# EAGLE design can (EAGLE 7.4.0)
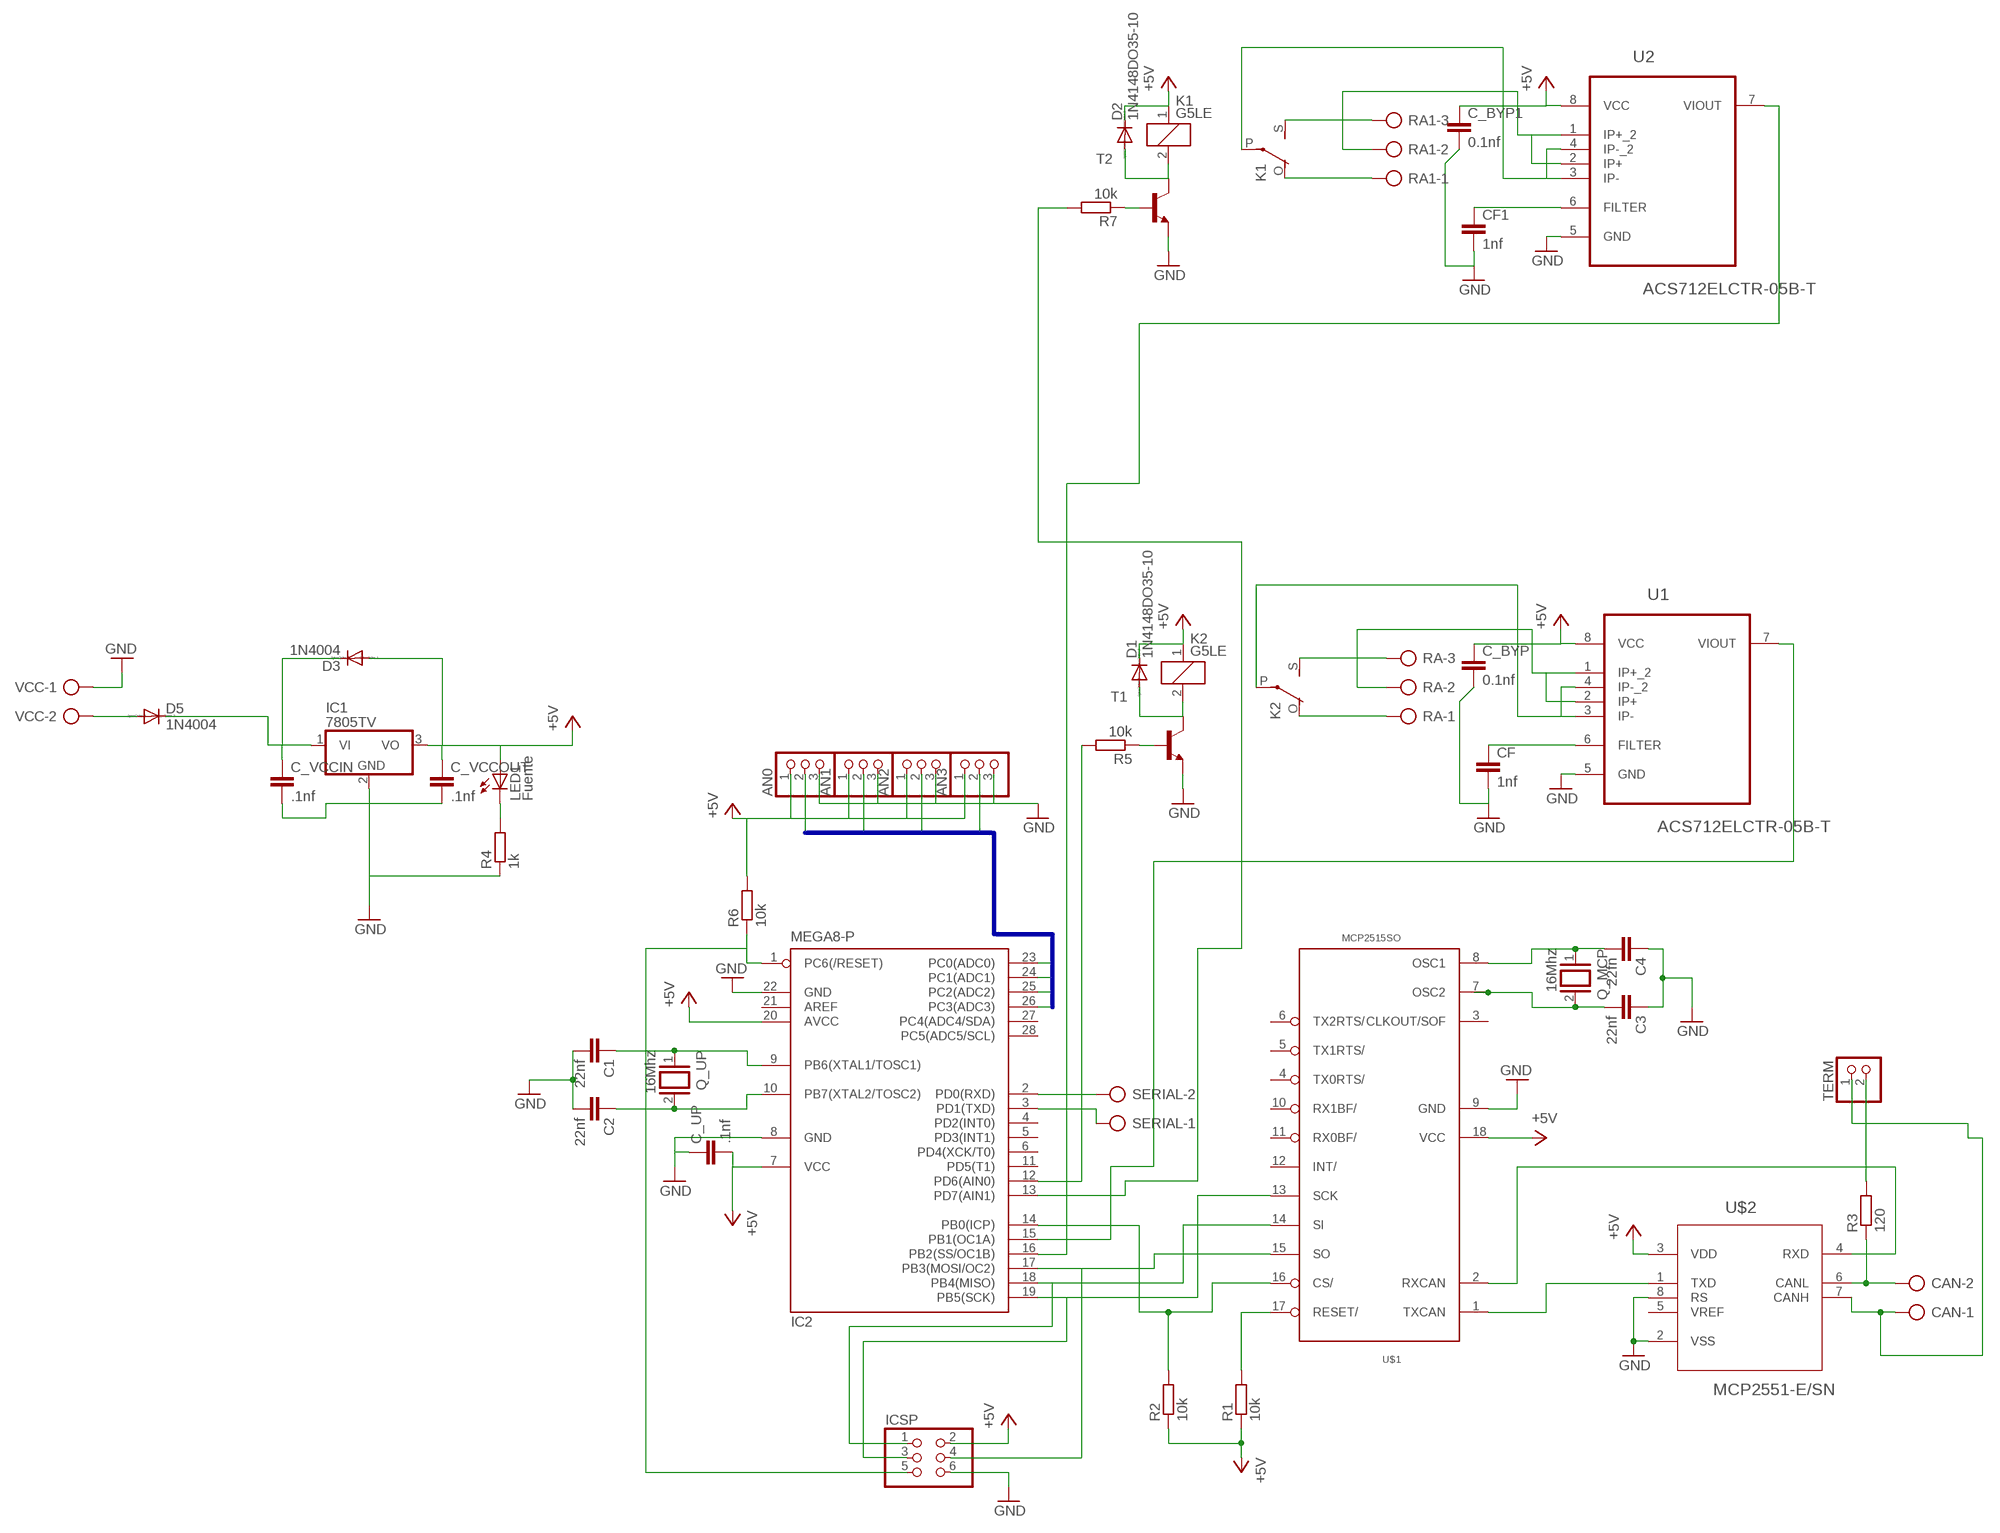
[diagram p0: schematic, sheet 1]

## Parts
AN0  PINHD-1X3  [1X03]
AN1  PINHD-1X3  [1X03]
AN2  PINHD-1X3  [1X03]
AN3  PINHD-1X3  [1X03]
C1  22nf  C-EU025-025X050  [C025-025X050]
C2  22nf  C-EU025-025X050  [C025-025X050]
C3  22nf  C-EU025-025X050  [C025-025X050]
C4  22fn  C-EU025-025X050  [C025-025X050]
C_BYP  0.1nf  C-EU025-025X050  [C025-025X050]
C_BYP1  0.1nf  C-EU025-025X050  [C025-025X050]
C_UP  .1nf  C-EU025-025X050  [C025-025X050]
C_VCCIN  .1nf  C-EU025-025X050  [C025-025X050]
C_VCCOUT  .1nf  C-EU025-025X050  [C025-025X050]
CAN  AK500/2  [AK500/2]
CF  1nf  C-EU025-025X050  [C025-025X050]
CF1  1nf  C-EU025-025X050  [C025-025X050]
D1  1N4148DO35-10  [DO35-10]
D2  1N4148DO35-10  [DO35-10]
D3  1N4004  [DO41-10]
D5  1N4004  [DO41-10]
IC1  7805TV  [TO220V]
IC2  MEGA8-P  [DIL28-3]
ICSP  PINHD-2X3  [2X03]
K1  G5LE  [G5LE]
K2  G5LE  [G5LE]
LED1  Fuente  LED3MM  [LED3MM]
Q_MCP  16Mhz  XTAL/S  [QS]
Q_UP  16Mhz  XTAL/S  [QS]
R1  10k  R-EU_0207/10  [0207/10]
R2  10k  R-EU_0207/10  [0207/10]
R3  120  R-EU_0207/10  [0207/10]
R4  1k  R-EU_0207/10  [0207/10]
R5  10k  R-EU_0207/10  [0207/10]
R6  10k  R-EU_0207/10  [0207/10]
R7  10k  R-EU_0207/10  [0207/10]
RA  AK500/3  [AK500/3]
RA1  AK500/3  [AK500/3]
SERIAL  AK500/2  [AK500/2]
T1  BC548-NPN-TO92-CBE  [TO92-CBE]
T2  BC548-NPN-TO92-CBE  [TO92-CBE]
TERM  PINHD-1X2  [1X02]
U1  ACS712ELCTR-05B-T  [SOIC127P600X175-8N]
U2  ACS712ELCTR-05B-T  [SOIC127P600X175-8N]
U$1  MCP2515SO  [SO18L]
U$2  MCP2551-E/SN  [SOIC127P600X175-8N]
VCC  AK500/2  [AK500/2]

## Nets
B0: AN0.2 IC2.23(PC0(ADC0))
B1: AN1.2 IC2.24(PC1(ADC1))
B2: AN2.2 IC2.25(PC2(ADC2))
B3: AN3.2 IC2.26(PC3(ADC3))
GND: AN0.3 AN1.3 AN2.3 AN3.3 C1.2 C2.2 C3.1 C4.1 C_BYP1.2 C_BYP.2 C_UP.1 C_VCCIN.2 C_VCCOUT.2 CF1.2 CF.2 IC1.2(GND) IC2.8(GND) IC2.22(GND) ICSP.6 R4.1 T1.E T2.E U1.5(GND) U2.5(GND) U$1.9(GND) U$2.2(VSS) U$2.8(RS) VCC.1
N$1: C1.1 IC2.9(PB6(XTAL1/TOSC1)) Q_UP.1
N$2: C2.1 IC2.10(PB7(XTAL2/TOSC2)) Q_UP.2
N$3: IC2.17(PB3(MOSI/OC2)) ICSP.4 U$1.15(SO)
N$4: IC2.14(PB0(ICP)) R2.2 U$1.16(CS/)
N$5: CAN.2 R3.1 U$2.6(CANL)
N$6: IC2.16(PB2(SS/OC1B)) U2.7(VIOUT)
N$7: IC2.19(PB5(SCK)) ICSP.3 U$1.13(SCK)
N$8: C4.2 Q_MCP.1 U$1.8(OSC1)
N$9: C3.2 Q_MCP.2 U$1.7(OSC2)
N$10: D1.A K2.2 T1.C
N$11: U$1.1(TXCAN) U$2.1(TXD)
N$12: U$1.2(RXCAN) U$2.4(RXD)
N$13: R1.2 U$1.17(RESET/)
N$14: CAN.1 TERM.1 U$2.7(CANH)
N$15: R3.2 TERM.2
N$16: R5.1 T1.B
N$17: LED1.K(C) R4.2
N$18: RA.2 U1.1(IP+_2) U1.2(IP+)
N$19: K2.O(2:O) RA.1
N$20: K2.S(2:S) RA.3
N$21: IC2.1(PC6(/RESET)) ICSP.5 R6.1
N$22: IC2.2(PD0(RXD)) SERIAL.2
N$23: IC2.3(PD1(TXD)) SERIAL.1
N$24: IC2.12(PD6(AIN0)) R5.2
N$25: IC2.15(PB1(OC1A)) U1.7(VIOUT)
N$26: CF.1 U1.6(FILTER)
N$27: K2.P(2:P) U1.3(IP-) U1.4(IP-_2)
N$28: D2.A K1.2 T2.C
N$29: D5.A VCC.2
N$30: R7.1 T2.B
N$31: K1.O(2:O) RA1.1
N$32: K1.S(2:S) RA1.3
N$33: IC2.13(PD7(AIN1)) R7.2
N$34: K1.P(2:P) U2.3(IP-) U2.4(IP-_2)
N$35: RA1.2 U2.1(IP+_2) U2.2(IP+)
N$36: CF1.1 U2.6(FILTER)
N$38: IC2.18(PB4(MISO)) ICSP.1 U$1.14(SI)
N$41: C_VCCIN.1 D3.C D5.C IC1.1(VI)
VCC: AN0.1 AN1.1 AN2.1 AN3.1 C_BYP1.1 C_BYP.1 C_UP.2 C_VCCOUT.1 D1.C D2.C D3.A IC1.3(VO) IC2.7(VCC) IC2.20(AVCC) ICSP.2 K1.1 K2.1 LED1.A R1.1 R2.1 R6.2 U1.8(VCC) U2.8(VCC) U$1.18(VCC) U$2.3(VDD) ; supply symbol labelled +5V
Unconnected: IC2.4(PD2(INT0)) IC2.5(PD3(INT1)) IC2.6(PD4(XCK/T0)) IC2.11(PD5(T1)) IC2.21(AREF) IC2.27(PC4(ADC4/SDA)) IC2.28(PC5(ADC5/SCL)) U$1.3(CLKOUT/SOF) U$1.4(TX0RTS/) U$1.5(TX1RTS/) U$1.6(TX2RTS/) U$1.10(RX1BF/) U$1.11(RX0BF/) U$1.12(INT/) U$2.5(VREF)

## Buses
B[0..3]

## Library data of the parts
AN0 AN1-AN3 = pinhead:PINHD-1X3: PIN HEADER
C1-C4 C_BYP C_BYP1 C_UP C_VCCIN C_VCCOUT CF CF1 = rcl:C-EU: CAPACITOR, European symbol
CAN SERIAL VCC = con-ptr500:AK500/2: CONNECTOR; OC_FARNELL: unknown; OC_NEWARK: unknown
D1 D2 = diode:1N4148: DIODE high speed (Philips)
D3 D5 = diode:1N4004: DIODE general purpose rectifier, 1 A
IC1 = linear:78*: Positive VOLTAGE REGULATOR Source: http://cache.national.com/ds/LM/LM78L05.pdf http://www.fairchildsemi.com/ds/LM/LM7805.pdf
IC2 = atmel:MEGA8-P: MICROCONTROLLER 8 Kbytes FLASH, 1 kbytes SRAM, 512 bytes EEPROM, USART, 4-channel 10 bit ADC, 2-channel 8 bit ADC Pin compatible with Atmega48, ATMega88, ATMega168 Source: avr.lbr; OC_FARNELL: unknown; OC_NEWARK: unknown
ICSP = pinhead:PINHD-2X3: PIN HEADER
K1 K2 = relay:G5LE: RELAY 1 x switch, 10 A/120 V AC, 8 A/30 V DC, Omron; OC_FARNELL: unknown; OC_NEWARK: unknown
LED1 = adafruit:LED: LED OSRAM: - CHIPLED LG R971, LG N971, LY N971, LG Q971, LY Q971, LO R971, LY R971 LH N974, LH R974 LS Q976, LO Q976, LY Q976 LO Q996 - Hyper CHIPLED LW Q18S LB Q993, LB Q99A, LB R99A - SideLED LS A670, LO A670, LY A670, LG A670, LP A670 LB A673, LV A673, LT A673, LW A673 LH A674 LY A675 LS A676, LA A676, LO A676, LY A676, LW A676 LS A679, LY A679, LG A679 - Hyper Micro SIDELED® LS Y876, LA Y876, LO Y876, LY Y876 LT Y87S - SmartLED LW L88C, LW L88S LB L89C, LB L89S, LG L890 LS L89K, LO L89K, LY L89K LS L896, LA L896, LO L896, LY L896 - TOPLED LS T670, LO T670, LY T670, LG T670, LP T670 LSG T670, LSP T670, LSY T670, LOP T670, LYG T670 LG T671, LOG T671, LSG T671 LB T673, LV T673, LT T673, LW T673 LH T674 LS T676, LA T676, LO T676, LY T676, LB T676, LH T676, LSB T676, LW T676 LB T67C, LV T67C, LT T67C, LS T67K, LO T67K, LY T67K, LW E67C LS E67B, LA E67B, LO E67B, LY E67B, LB E67C, LV E67C, LT E67C LW T67C LS T679, LY T679, LG T679 LS T770, LO T770, LY T770, LG T770, LP T770 LB T773, LV T773, LT T773, LW T773 LH T774 LS E675, LA E675, LY E675, LS T675 LS T776, LA T776, LO T776, LY T776, LB T776 LHGB T686 LT T68C, LB T68C - Hyper Mini TOPLED® LB M676 - Mini TOPLED Santana® LG M470 LS M47K, LO M47K, LY M47K Source: http://www.osram.convergy.de/
Q_MCP Q_UP = special:XTAL/S: CRYSTAL
R1-R7 = rcl:R-EU_: RESISTOR, European symbol
RA RA1 = con-ptr500:AK500/3: CONNECTOR; OC_FARNELL: unknown; OC_NEWARK: unknown
T1 T2 = transistor:*-NPN-: NPN Transistror BF959 corrected 2008.03.06
TERM = pinhead:PINHD-1X2: PIN HEADER
U1 U2 = Allegro_By_element14_Batch_1:ACS712ELCTR-05B-T: Linear Current Sensor; MPN: ACS712ELCTR-05B-T; OC_FARNELL: 1329623; OC_NEWARK: 27M3644; PACKAGE: SOIC-8; SUPPLIER: Allegro
U$1 = MCP2515_MT:MCP2515*: MCP2515 Standalone CAN-Controller by Microchip Eagle-Lib. by MartinThomas
U$2 = MCP2551superficial:MCP2551-E/SN: High-Speed CAN Transceiver; DESCRIPTION: High-Speed CAN Transceiver; MPN: MCP2551-E/SN; OC_FARNELL: 1467746; OC_NEWARK: 92C4186; PACKAGE: SOIC-8; SUPPLIER: Microchip

## Board
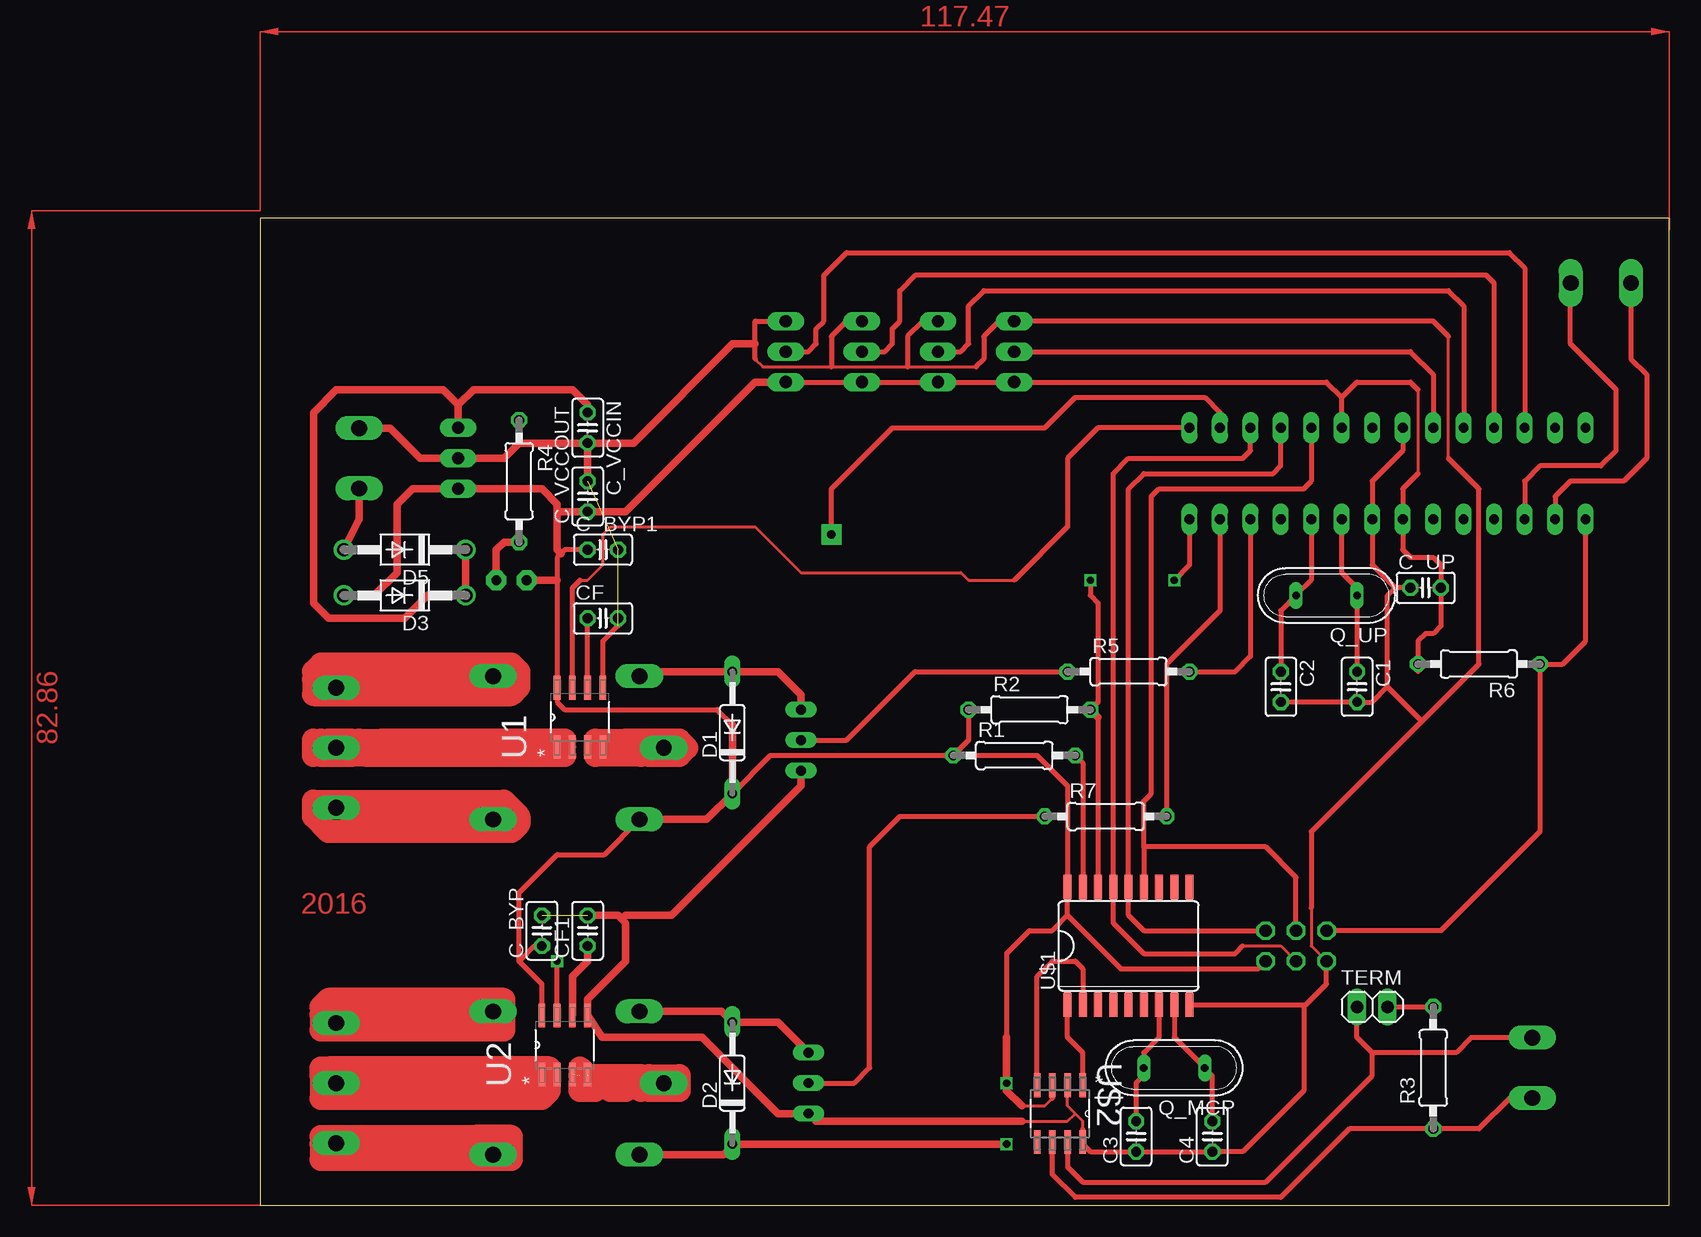
[diagram p1: board, top side]
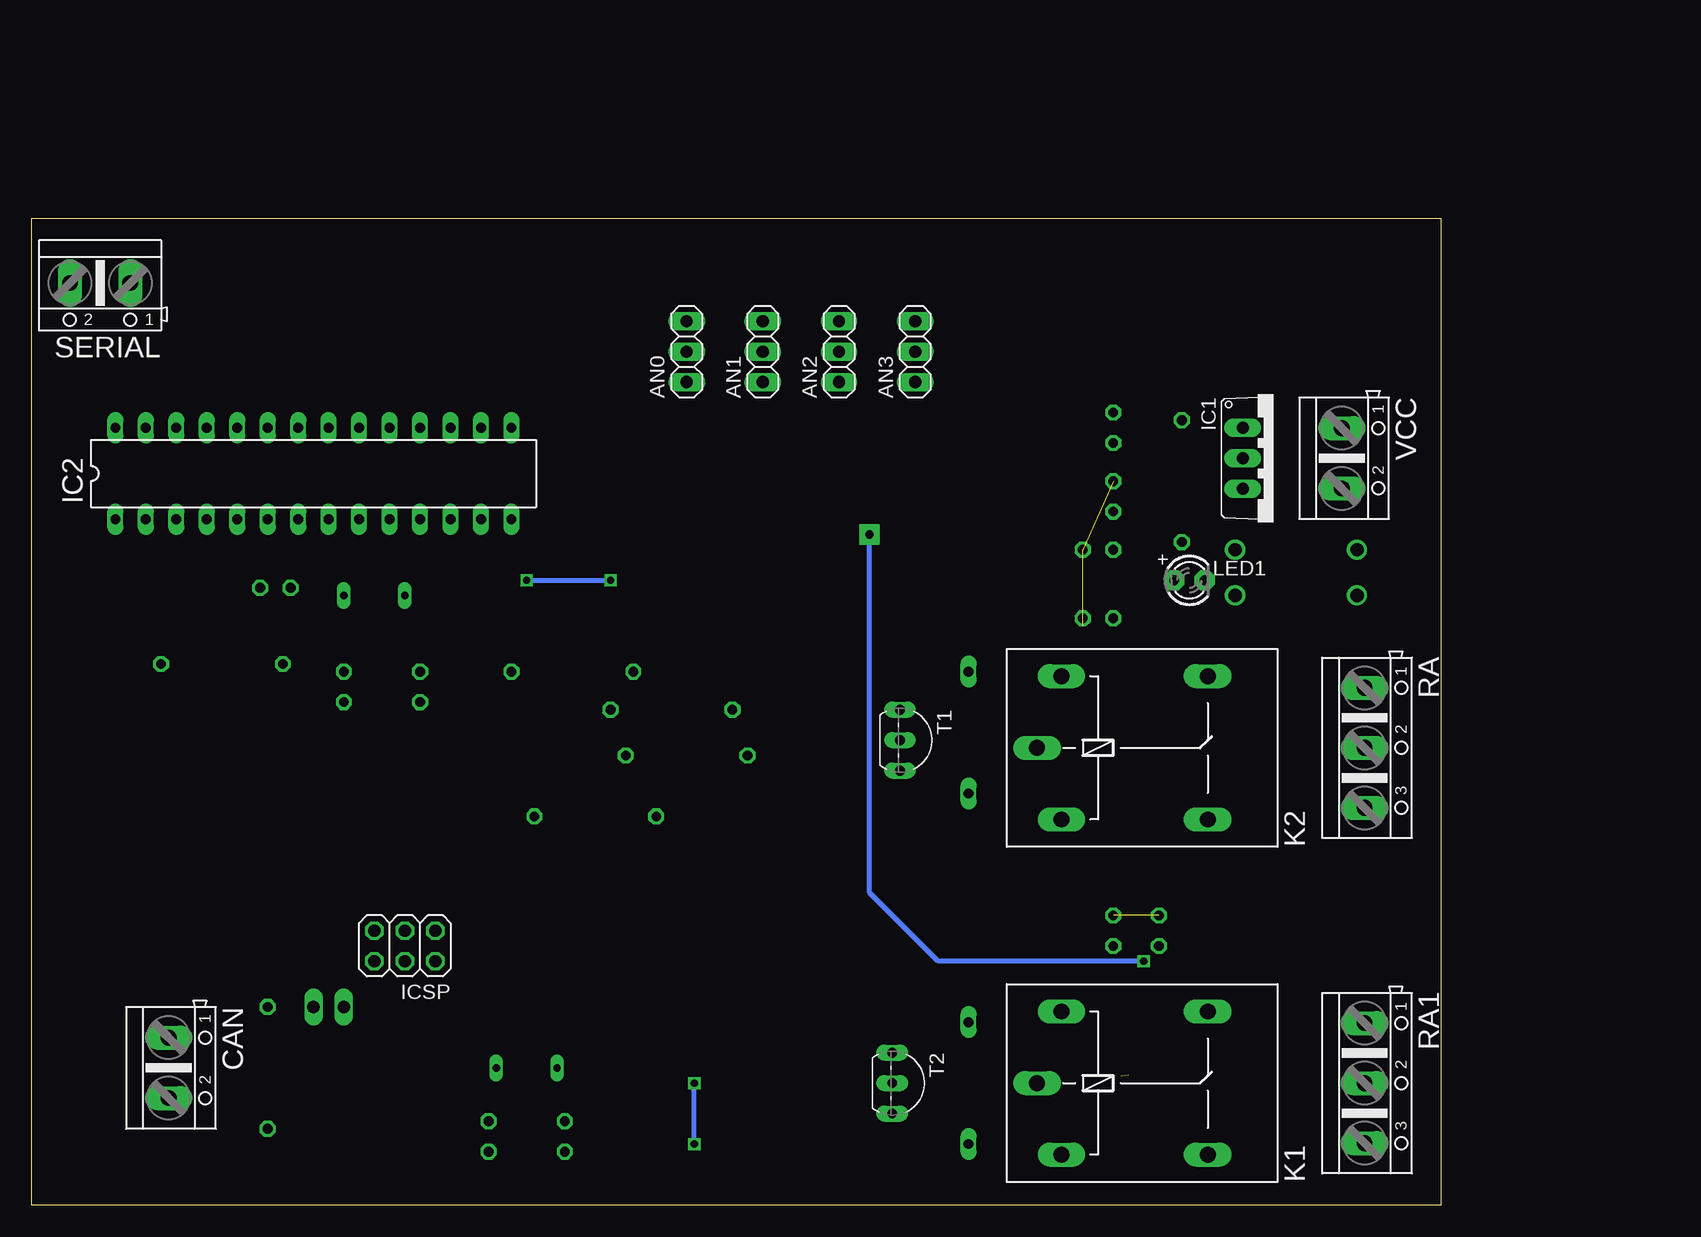
[diagram p2: board, bottom side, seen from below]

Size 117.45 x 82.22 mm. Coordinates in mm from the lower left corner, seen from the top.
Outline: 0,0 117.45,0 117.45,82.22 0,82.22 0,0
Copper layers (1*16): Top 0.035mm / dielectric 1.5mm / Bottom 0.035mm
Design rules "default *": minimum track width 10mil, minimum drill 24mil, track to track 12mil, track to pad 12mil, pad to pad 12mil, via to via 12mil, smd to smd 12mil, copper to edge 40mil, drill to drill 8mil, minimum pad ring 10mil, minimum via ring 8mil, stop-mask expansion 4mil, vias tented up to drill 0mil, thermal gap 10mil

### Footprints (pad centres in the part's own frame; a part is rotated, then mirrored left to right if it is on the bottom)
1X03 = drill 1.016 long: 1 -2.54,0; 2 0,0; 3 2.54,0
C025-025X050 = drill 0.813 octagon: 1 -1.27,0; 2 1.27,0
AK500/2 = drill 1.321 long: 1 -2.515,0; 2 2.515,0
DO35-10 = drill 0.813 long: A 5.08,0; C -5.08,0
DO41-10 = drill 1.118: A 5.08,0; C -5.08,0
TO220V = drill 1.016 long: 1 -2.54,-2.54; 2 0,-2.54; 3 2.54,-2.54
DIL28-3 = drill 0.813 long: 1 -16.51,-3.81; 2 -13.97,-3.81; 3 -11.43,-3.81; 4 -8.89,-3.81; 5 -6.35,-3.81; 6 -3.81,-3.81; 7 -1.27,-3.81; 8 1.27,-3.81; 9 3.81,-3.81; 10 6.35,-3.81; 11 8.89,-3.81; 12 11.43,-3.81; 13 13.97,-3.81; 14 16.51,-3.81; 15 16.51,3.81; 16 13.97,3.81; 17 11.43,3.81; 18 8.89,3.81; 19 6.35,3.81; 20 3.81,3.81; 21 1.27,3.81; 22 -1.27,3.81; 23 -3.81,3.81; 24 -6.35,3.81; 25 -8.89,3.81; 26 -11.43,3.81; 27 -13.97,3.81; 28 -16.51,3.81
2X03 = drill 1.016 octagon: 1 -2.54,-1.27; 2 -2.54,1.27; 3 0,-1.27; 4 0,1.27; 5 2.54,-1.27; 6 2.54,1.27
G5LE = drill 1.321 long: 1 -7.493,-5.969; 2 -7.493,5.969; O 4.699,5.969; P -9.525,0; S 4.699,-5.969
LED3MM = drill 0.813 pad 1.676 octagon: A -1.27,0; K 1.27,0
QS = drill 0.61 long: 1 -2.54,0; 2 2.54,0
0207/10 = drill 0.813 octagon: 1 -5.08,0; 2 5.08,0
AK500/3 = drill 1.321 long: 1 -5.004,0; 2 0,0; 3 5.004,0
TO92-CBE = drill 0.813 long: B 0,0; C -2.54,0; E 2.54,0
1X02 = drill 1.016 long: 1 -1.27,0; 2 1.27,0
SOIC127P600X175-8N = smd 1.981 x 0.559: 1 -2.464,1.905; 2 -2.464,0.635; 3 -2.464,-0.635; 4 -2.464,-1.905; 5 2.464,-1.905; 6 2.464,-0.635; 7 2.464,0.635; 8 2.464,1.905
SO18L = smd 0.66 x 2.032: 1 -5.08,-4.902; 2 -3.81,-4.902; 3 -2.54,-4.902; 4 -1.27,-4.902; 5 0,-4.902; 6 1.27,-4.902; 7 2.54,-4.902; 8 3.81,-4.902; 9 5.08,-4.902; 10 5.08,4.902; 11 3.81,4.902; 12 2.54,4.902; 13 1.27,4.902; 14 0,4.902; 15 -1.27,4.902; 16 -2.54,4.902; 17 -3.81,4.902; 18 -5.08,4.902
SOIC127P600X175-8N' = smd 1.981 x 0.559: 1 -2.362,1.905; 2 -2.362,0.635; 3 -2.362,-0.635; 4 -2.362,-1.905; 5 2.362,-1.905; 6 2.362,-0.635; 7 2.362,0.635; 8 2.362,1.905

### Placement (x,y rotation side)
AN0  62.87,71.12 90 bottom
AN1  56.52,71.12 90 bottom
AN2  50.16,71.12 90 bottom
AN3  43.81,71.12 90 bottom
C1  91.44,43.18 270 top
C2  85.09,43.18 270 top
C3  73.03,5.71 90 top
C4  79.38,5.71 90 top
C_BYP  23.5,22.86 90 top
C_BYP1  28.57,54.61 0 top
C_UP  97.16,51.44 0 top
C_VCCIN  27.3,64.77 270 top
C_VCCOUT  27.3,59.05 90 top
CAN  106.05,11.43 270 bottom
CF  28.57,48.9 0 top
CF1  27.3,22.86 90 top
D1  39.37,39.37 90 top
D2  39.37,10.16 90 top
D3  12.06,50.8 180 top
D5  12.06,54.61 180 top
IC1  13.97,62.23 270 bottom
IC2  93.98,60.96 0 bottom
ICSP  86.36,21.59 180 bottom
K1  24.13,10.16 0 bottom
K2  24.13,38.1 0 bottom
LED1  20.95,52.07 0 bottom
Q_MCP  76.2,11.43 180 top
Q_UP  88.9,50.8 180 top
R1  62.87,37.47 0 top
R2  64.14,41.27 0 top
R3  97.79,11.43 90 top
R4  21.59,60.33 270 top
R5  72.39,44.45 0 top
R6  101.6,45.09 180 top
R7  70.48,32.38 0 top
RA  6.35,38.1 270 bottom
RA1  6.35,10.16 270 bottom
SERIAL  111.76,76.83 180 bottom
T1  45.09,38.73 270 bottom
T2  45.72,10.16 270 bottom
TERM  92.71,16.51 0 top
U1  26.67,40.64 90 top
U2  25.4,13.34 90 top
U$1  72.39,21.59 0 top
U$2  MCP2551-E/SN  [SOIC127P600X175-8N']  66.67,7.62 270 top
VCC  8.26,62.23 270 bottom

### Tracks (layer width: path | path; a pad name or v marks a point on that pad's centre or on a via)
B0
  Top 0.406: AN0.2 95.89,71.12 97.79,69.22 IC2.23
B1
  Top 0.406: AN1.2 58.42,71.12 59.05,71.75 59.05,74.93 60.33,76.2 99.06,76.2 100.33,74.93 IC2.24
B2
  Top 0.406: IC2.25 102.87,76.83 102.23,77.47 54.61,77.47 53.34,76.2 53.34,73.66 52.7,73.03 52.7,71.75 52.07,71.12 AN2.2
B3
  Top 0.406: AN3.2 45.72,71.12 46.35,71.75 46.35,73.03 46.99,73.66 46.99,77.47 48.9,79.38 104.14,79.38 105.41,78.11 IC2.26
GND  (4 unrouted)
  Top 0.254: 99.06,62.23 99.06,72.39 | 87.63,24.77 87.63,21.59 ICSP.6 | 68.58,6.35 68.58,6.99 67.94,7.62 | 67.94,7.62 67.31,8.26 U$2.2 | 63.5,6.99 67.31,6.99 67.94,7.62 | 41.27,70.48 41.91,69.85 47.62,69.85 53.98,69.85 59.69,69.85
  Top 0.406: IC2.22 95.25,62.87 92.71,60.33 IC2.8 92.71,53.34 94.61,51.44 | ICSP.6 88.9,18.41 87.17,16.69 U$1.9 86.82,16.69 87,16.51 87,9.53 81.92,4.45 C4.1 C3.1 69.22,4.45 68.58,5.08 U$2.8 68.58,6.35 | U1.5 28.57,46.99 29.84,48.26 | C_UP.1 94.61,51.44 | 93.98,43.18 93.98,50.8 94.61,51.44 | AN3.3 41.27,73.66 41.27,71.75 41.27,70.48 | 99.06,62.23 101.6,59.69 101.6,45.09 96.84,40.32 | 99.06,72.39 97.79,73.66 AN0.3 61.59,73.66 60.33,72.39 60.33,70.48 59.69,69.85 | 46.35,6.99 T2.E | 96.84,40.32 87.63,31.11 87.63,24.77 | 93.98,43.18 92.71,41.91 C1.2 C2.2 | 93.98,43.18 96.84,40.32 | AN1.3 55.24,73.66 53.98,72.39 53.98,69.85 | AN2.3 48.9,73.66 47.62,72.39 47.62,69.85
  Top 0.61: T2.E 43.18,7.62 36.83,13.97 28.5,13.97 U2.5 27.3,17.14 30.48,20.32 30.48,23.5 30.16,23.81 | 30.16,23.81 29.84,24.13 CF1.2 | 46.35,6.99 63.5,6.99 | VCC.1 10.82,64.75 13.34,62.23 IC1.2 20.32,62.23 21.59,63.5 | C_VCCIN.2 21.59,63.5 | 21.59,63.5 R4.1 | C_VCCIN.2 C_VCCOUT.2 | C_VCCIN.2 31.11,63.5 39.37,71.75 41.27,71.75 | 30.16,23.81 30.48,24.13 34.29,24.13 45.09,34.92 T1.E
N$1
  Top 0.406: IC2.9 90.17,52.7 91.44,51.44 Q_UP.1 C1.1
N$2
  Top 0.406: IC2.10 87.63,52.07 Q_UP.2 85.09,49.53 C2.1
N$3
  Top 0.254: 81.92,21.59 85.09,21.59 ICSP.4
  Top 0.406: IC2.17 82.55,62.87 81.92,62.23 72.39,62.23 71.12,60.96 U$1.15 71.12,23.5 73.66,20.95 81.28,20.95 81.92,21.59
N$4  (via drill 0.6)
  Top 0.406: 69.85,40.64 U$1.16 | IC2.14 77.47,53.34 v76.2,52.07 | v69.22,52.07 69.22,50.8 69.85,50.16 69.85,41.91 R2.2
  Top 0.61: R2.2 69.85,40.64
  Bottom 0.406: v76.2,52.07 v69.22,52.07
N$5
  Top 0.406: CAN.2 104.17,8.91 101.6,6.35 R3.1 90.81,6.35 85.09,0.64 67.94,0.64 66.04,2.54 U$2.6
N$6  (via drill 0.6 pad 1.02, 0.7 pad 1.68)
  Top 0.406: U2.7 v24.77,20.32 | v47.62,55.88 47.62,59.69 52.7,64.77 65.41,64.77 67.94,67.31 78.74,67.31 80.01,66.04 IC2.16
  Bottom 0.406: v24.77,20.32 41.91,20.32 47.62,26.04 v47.62,55.88
N$7
  Top 0.406: 73.66,29.84 U$1.13 | ICSP.3 86.36,27.3 83.82,29.84 73.66,29.84 | IC2.19 87.63,60.33 87,59.69 74.93,59.69 74.3,59.05 74.3,34.29 73.66,33.66 73.66,29.84
N$8
  Top 0.406: U$1.8 76.2,13.97 Q_MCP.1 79.38,10.79 C4.2
N$9
  Top 0.406: U$1.7 74.93,13.97 73.66,12.7 Q_MCP.2 73.66,10.79 73.03,10.16 C3.2
N$10
  Top 0.61: T1.C 45.09,42.55 43.18,44.45 D1.A 32,44.45 K2.2
N$11
  Top 0.406: U$2.1 68.58,12.7 67.31,13.97 U$1.1
N$12
  Top 0.406: U$2.4 64.77,19.05 66.04,20.32 67.94,20.32 68.58,19.68 U$1.2
N$13
  Top 0.406: R1.2 68.58,36.83 U$1.17
N$14
  Top 0.406: CAN.1 100.94,13.95 99.69,12.7 92.71,12.7 | 92.71,12.7 91.44,13.97 TERM.1 | U$2.7 67.31,3.17 68.58,1.91 83.82,1.91 92.71,10.79 92.71,12.7
N$15
  Top 0.406: TERM.2 R3.2
N$16
  Top 0.406: T1.B 48.9,38.73 54.61,44.45 R5.1
N$17
  Top 0.61: R4.2 20.32,55.24 19.68,54.61 LED1.K
N$18
  Top 0.61: U1.1 U1.2
  Top 1.93: RA.2 5.71,38.1 5.08,38.73 5.71,38.73 | 7.62,38.73 5.71,38.73 | 5.71,38.73 5.08,38.1 4.45,38.1 5.08,37.47 7.62,37.47 8.26,38.1 8.26,38.73 10.16,38.73 | 25.4,38.73 10.16,38.73 | 10.16,38.73 8.89,37.47 | 8.89,37.47 25.4,37.47 | 8.89,37.47 4.45,37.47 4.45,38.73 24.21,38.73 U1.1
N$19
  Top 1.93: RA.1 5.79,43.1 5.08,43.81 4.45,43.81 4.45,42.55 20.95,42.55 21.59,43.18 21.59,44.45 20.95,45.09 5.08,45.09 4.45,44.45 17.14,44.45 17.78,43.81 19.18,43.81 K2.O
N$20
  Top 1.93: RA.3 20.88,33.1 | 20.88,33.1 21.59,32.38 | 21.59,32.38 21.59,31.75 20.95,31.11 5.71,31.11 4.45,32.38 4.45,33.66 20.32,33.66 20.88,33.1 | 21.59,32.38 19.18,32.38 | 7.62,32.38 19.18,32.38 | 19.18,32.38 K2.S
N$21
  Top 0.406: IC2.1 110.49,46.99 108.58,45.09 R6.1 106.68,31.11 98.42,22.86 ICSP.5
N$22
  Top 0.406: SERIAL.2 114.28,70.51 115.57,69.22 115.57,62.23 113.67,60.33 109.22,60.33 107.95,59.05 IC2.2
N$23
  Top 0.406: SERIAL.1 109.22,76.81 109.22,71.75 113.03,67.94 113.03,62.87 111.76,61.59 106.68,61.59 105.41,60.33 IC2.3
N$24
  Top 0.406: IC2.12 82.55,45.72 81.28,44.45 R5.2
N$25
  Top 0.254: 26.67,52.07 27.3,52.07 28.57,53.34 28.57,55.88 29.21,56.52 41.27,56.52 45.09,52.7 58.42,52.7 59.05,52.07 62.87,52.07
  Top 0.406: U1.7 26.04,51.44 26.67,52.07 | IC2.15 69.85,64.77 67.31,62.23 67.31,56.52 62.87,52.07
N$26
  Top 0.406: U1.6 CF.1
N$27
  Top 0.406: 33.58,38.18 K2.P
  Top 0.61: U1.4 U1.3
  Top 1.93: 33.58,38.18 34.37,38.18 34.92,38.73 | 34.92,38.73 32.38,38.73 | 32.38,38.73 31.75,38.1 32.38,37.47 34.92,37.47 35.56,38.1 34.92,38.73 | 32.38,38.73 30.48,38.73 | 27.94,38.73 30.48,38.73 | 30.48,38.73 31.75,37.47 27.94,37.47 27.94,37.54 U1.4
N$28
  Top 0.61: K1.2 38.48,16.13 D2.A 43.18,15.24 T2.C
N$29
  Top 0.61: VCC.2 8.26,57.15 D5.A
N$30
  Top 0.406: T2.B 49.53,10.16 50.8,11.43 50.8,29.84 53.34,32.38 R7.1
N$31
  Top 1.93: RA1.1 5.79,15.16 5.08,15.88 5.08,14.61 20.32,14.61 20.32,17.14 5.71,17.14 5.08,16.51 19.05,16.51 K1.O
N$32
  Top 1.93: RA1.3 5.16,5.16 5.08,5.08 5.08,3.81 20.95,3.81 20.95,5.71 17.91,5.71 | 5.08,5.71 17.91,5.71 | 17.91,5.71 K1.S
N$33
  Top 0.406: IC2.13 80.01,49.53 75.56,45.09 R7.2
N$34  (2 unrouted)
  Top 1.93: K1.P 33.02,10.16 32.38,10.79 34.92,10.79 34.92,9.53 32.38,9.53 31.75,10.16 | 31.75,10.16 31.75,9.53 | 31.75,10.16 31.75,10.79 27.3,10.79 26.67,11.43 26.67,10.79 26.67,10.16 | 26.67,10.16 28.57,10.16 | 28.57,10.16 29.84,10.16 30.48,9.53 29.21,9.53 28.57,10.16 | 28.57,10.16 27.94,9.53 26.67,9.53 26.67,10.16
N$35
  Top 0.61: U2.1 24.13,10.87 U2.2
  Top 1.422: 23.42,10.16 24.13,10.87
  Top 1.93: RA1.2 5.71,10.16 5.08,10.79 | 5.08,10.79 5.08,8.89 23.5,8.89 24.13,9.53 24.13,11.43 5.71,11.43 5.08,10.79 | 5.08,10.79 5.08,11.43 7.62,11.43 8.89,10.16 | 8.89,10.16 8.26,10.16 | 8.89,10.16 23.42,10.16
N$36
  Top 0.61: CF1.1 27.3,20.32 26.04,19.05 U2.6
N$38
  Top 0.406: IC2.18 85.09,61.59 84.45,60.96 73.66,60.96 72.39,59.69 U$1.14 72.39,24.13 73.66,22.86 ICSP.1
N$41
  Top 0.61: D5.C D3.C 13.97,50.8 12.06,48.9 5.71,48.9 4.45,50.16 4.45,66.04 6.35,67.94 15.24,67.94 16.51,66.67 | 16.51,66.67 17.78,67.94 26.04,67.94 27.3,66.67 C_VCCIN.1 | IC1.1 16.51,66.67
VCC  (via drill 0.6)
  Top 0.254: 96.52,67.94 96.52,60.96 | 63.5,8.26 65.41,8.26 66.04,8.89
  Top 0.406: 67.31,24.13 71.75,19.68 83.19,19.68 ICSP.2 | 67.31,24.13 U$1.18 67.31,34.92 64.77,37.47 R1.1 | R2.1 59.05,38.73 R1.1 | D1.C 42.55,37.47 R1.1 | C_BYP1.1 25.4,54.61 25.08,54.29 24.77,53.98 24.77,52.07 U1.8 24.77,41.91 25.4,41.27 38.1,41.27 39.37,40.01 | 67.31,24.13 66.04,22.86 64.14,22.86 62.23,20.95 62.23,13.97 | 38.48,4.19 D2.C | 96.52,44.45 R6.2 96.52,46.99 97.16,47.62 97.79,47.62 98.42,48.26 C_UP.2 98.42,53.34 97.79,53.98 95.89,53.98 95.25,54.61 IC2.7 95.25,59.69 96.52,60.96 | AN3.1 AN2.1 AN1.1 AN0.1 88.9,68.58 90.17,67.31 | IC2.20 90.17,67.31 | 90.17,67.31 91.44,68.58 95.89,68.58 96.52,67.94 | U$2.3 66.04,8.89 | U2.8 23.5,18.41 21.59,20.32 | 21.59,20.32 21.59,26.04 24.77,29.21 28.7,29.21 K2.1 | C_BYP.1 22.86,21.59 21.59,20.32
  Top 0.61: K1.1 38.48,4.19 arc90 D2.C v62.23,5.08 | K2.1 37.21,32.13 D1.C 39.37,40.01 | 24.77,57.78 24.77,58.42 23.5,59.69 IC1.3 12.7,59.69 11.43,58.42 11.43,52.7 9.53,50.8 D3.A | 24.77,57.78 24.77,54.61 25.08,54.29 | LED1.A 24.77,52.07 | 24.77,57.78 C_VCCOUT.1 30.48,57.78 41.27,68.58 AN3.1 | 62.23,13.97 v62.23,10.16 62.23,9.53 63.5,8.26
  Bottom 0.406: v62.23,5.08 v62.23,10.16
(copper drawn outside any net)
  shapes: Top area x2

### Text on the board
Top: 2016